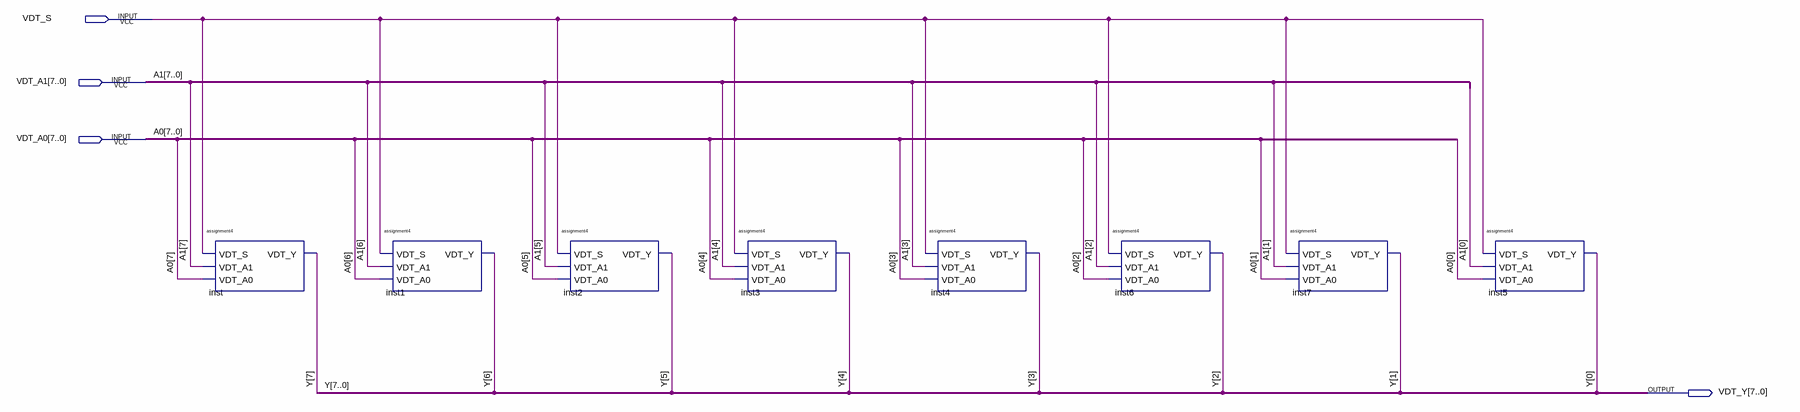
[diagram p0: schematic sheet]
// Quartus schematic assignment5.bdf as structural Verilog: 8 symbols, 4 pins
module assignment5 (
  input  VDT_S,
  input  [7:0] VDT_A1,
  input  [7:0] VDT_A0,
  output [7:0] VDT_Y
);

  assignment4 inst (.VDT_S(VDT_S), .VDT_A1(VDT_A1[7]), .VDT_A0(VDT_A0[7]), .VDT_Y(VDT_Y[7]));
  assignment4 inst1 (.VDT_S(VDT_S), .VDT_A1(VDT_A1[6]), .VDT_A0(VDT_A0[6]), .VDT_Y(VDT_Y[6]));
  assignment4 inst2 (.VDT_S(VDT_S), .VDT_A1(VDT_A1[5]), .VDT_A0(VDT_A0[5]), .VDT_Y(VDT_Y[5]));
  assignment4 inst3 (.VDT_S(VDT_S), .VDT_A1(VDT_A1[4]), .VDT_A0(VDT_A0[4]), .VDT_Y(VDT_Y[4]));
  assignment4 inst4 (.VDT_S(VDT_S), .VDT_A1(VDT_A1[3]), .VDT_A0(VDT_A0[3]), .VDT_Y(VDT_Y[3]));
  assignment4 inst6 (.VDT_S(VDT_S), .VDT_A1(VDT_A1[2]), .VDT_A0(VDT_A0[2]), .VDT_Y(VDT_Y[2]));
  assignment4 inst7 (.VDT_S(VDT_S), .VDT_A1(VDT_A1[1]), .VDT_A0(VDT_A0[1]), .VDT_Y(VDT_Y[1]));
  assignment4 inst5 (.VDT_S(VDT_S), .VDT_A1(VDT_A1[0]), .VDT_A0(VDT_A0[0]), .VDT_Y(VDT_Y[0]));

  // Other names for the same wires on the sheet: A0[7:0] = VDT_A0; A1[7:0] = VDT_A1; Y[7:0] = VDT_Y
endmodule
